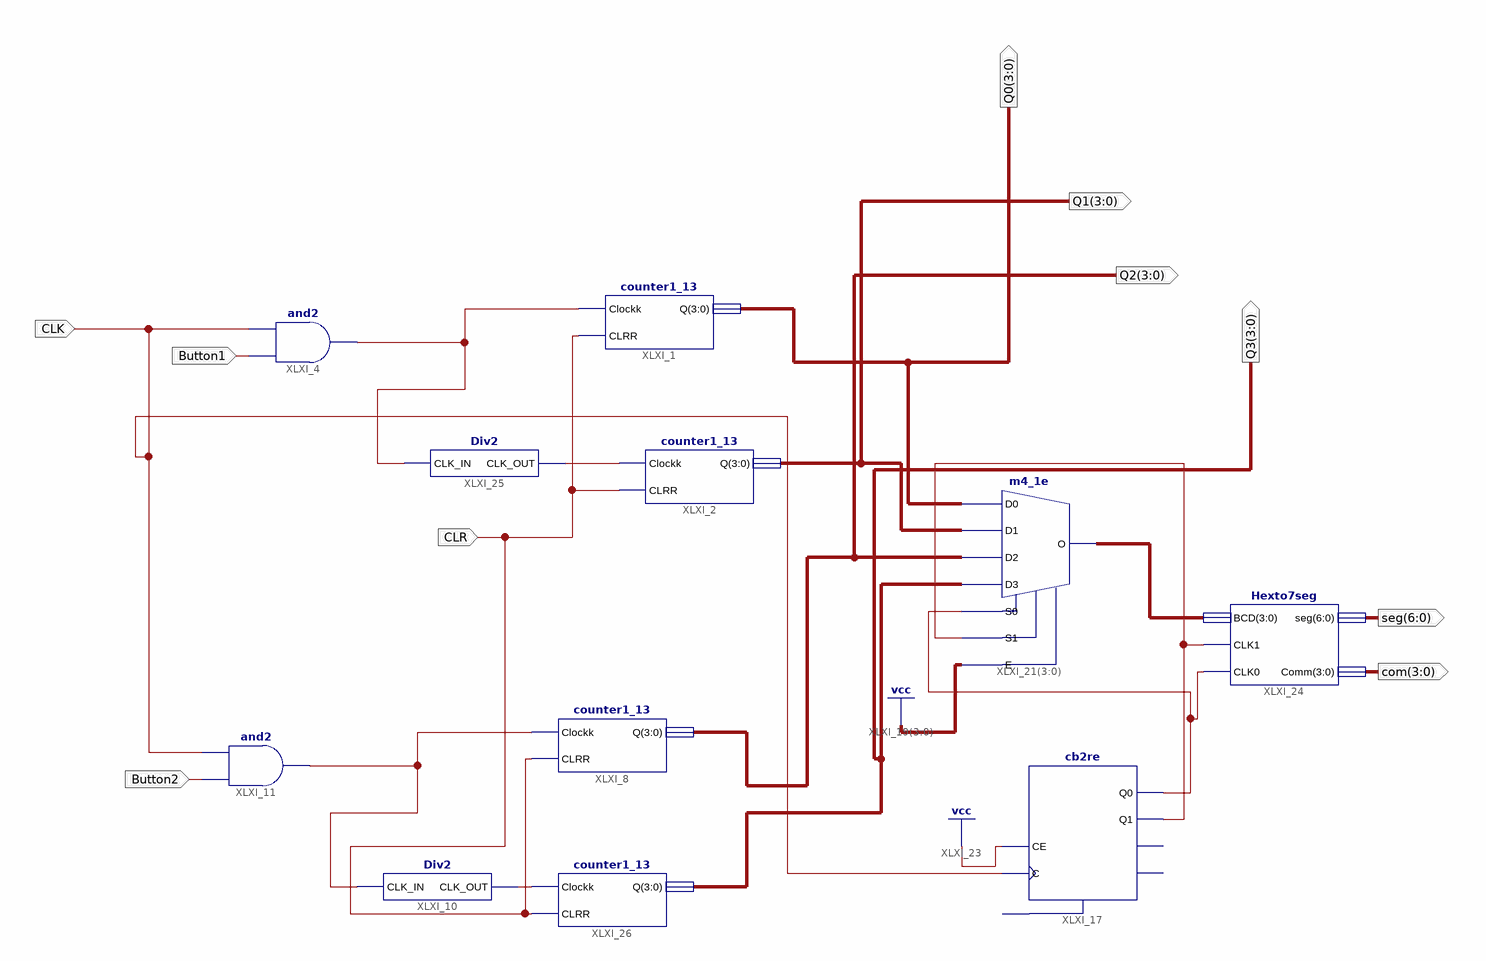
[diagram p0: schematic sheet 1]
// Xilinx ISE schematic random2digit.sch (spartan6) as structural Verilog: 11 symbols, 10 ports
module random2digit (
  input  CLR,
  input  Button1,
  input  CLK,
  input  Button2,
  output [3:0] Q0,
  output [3:0] Q1,
  output [3:0] Q2,
  output [3:0] Q3,
  output [6:0] seg,
  output [3:0] com
);

  wire XLXN_8, XLXN_20, XLXN_23, XLXN_46, XLXN_47, XLXN_60;
  wire [3:0] XLXN_45;

  counter1_13 XLXI_1 (.Clockk(XLXN_8), .CLRR(CLR), .Q(Q0));
  and XLXI_4 (XLXN_8, Button1, CLK);
  counter1_13 XLXI_8 (.Clockk(XLXN_23), .CLRR(CLR), .Q(Q2));
  Div2 XLXI_10 (.CLK_IN(XLXN_23), .CLK_OUT(XLXN_20));
  and XLXI_11 (XLXN_23, Button2, CLK);
  counter1_13 XLXI_2 (.Clockk(XLXN_60), .CLRR(CLR), .Q(Q1));
  cb2re XLXI_17 (.C(CLK), .CE(1'b1), .Q0(XLXN_46), .Q1(XLXN_47));  // open: R, CEO, TC
  m4_1e XLXI_21[3:0] (.D0(Q0), .D1(Q1), .D2(Q2), .D3(Q3), .E(4'b1111), .S0(XLXN_46), .S1(XLXN_47), .O(XLXN_45));
  Hexto7seg XLXI_24 (.BCD(XLXN_45), .CLK1(XLXN_47), .CLK0(XLXN_46), .seg(seg), .Comm(com));
  Div2 XLXI_25 (.CLK_IN(XLXN_8), .CLK_OUT(XLXN_60));
  counter1_13 XLXI_26 (.Clockk(XLXN_20), .CLRR(CLR), .Q(Q3));
endmodule
